# Altium schematic sheet Sheet2.SchDoc
size A4
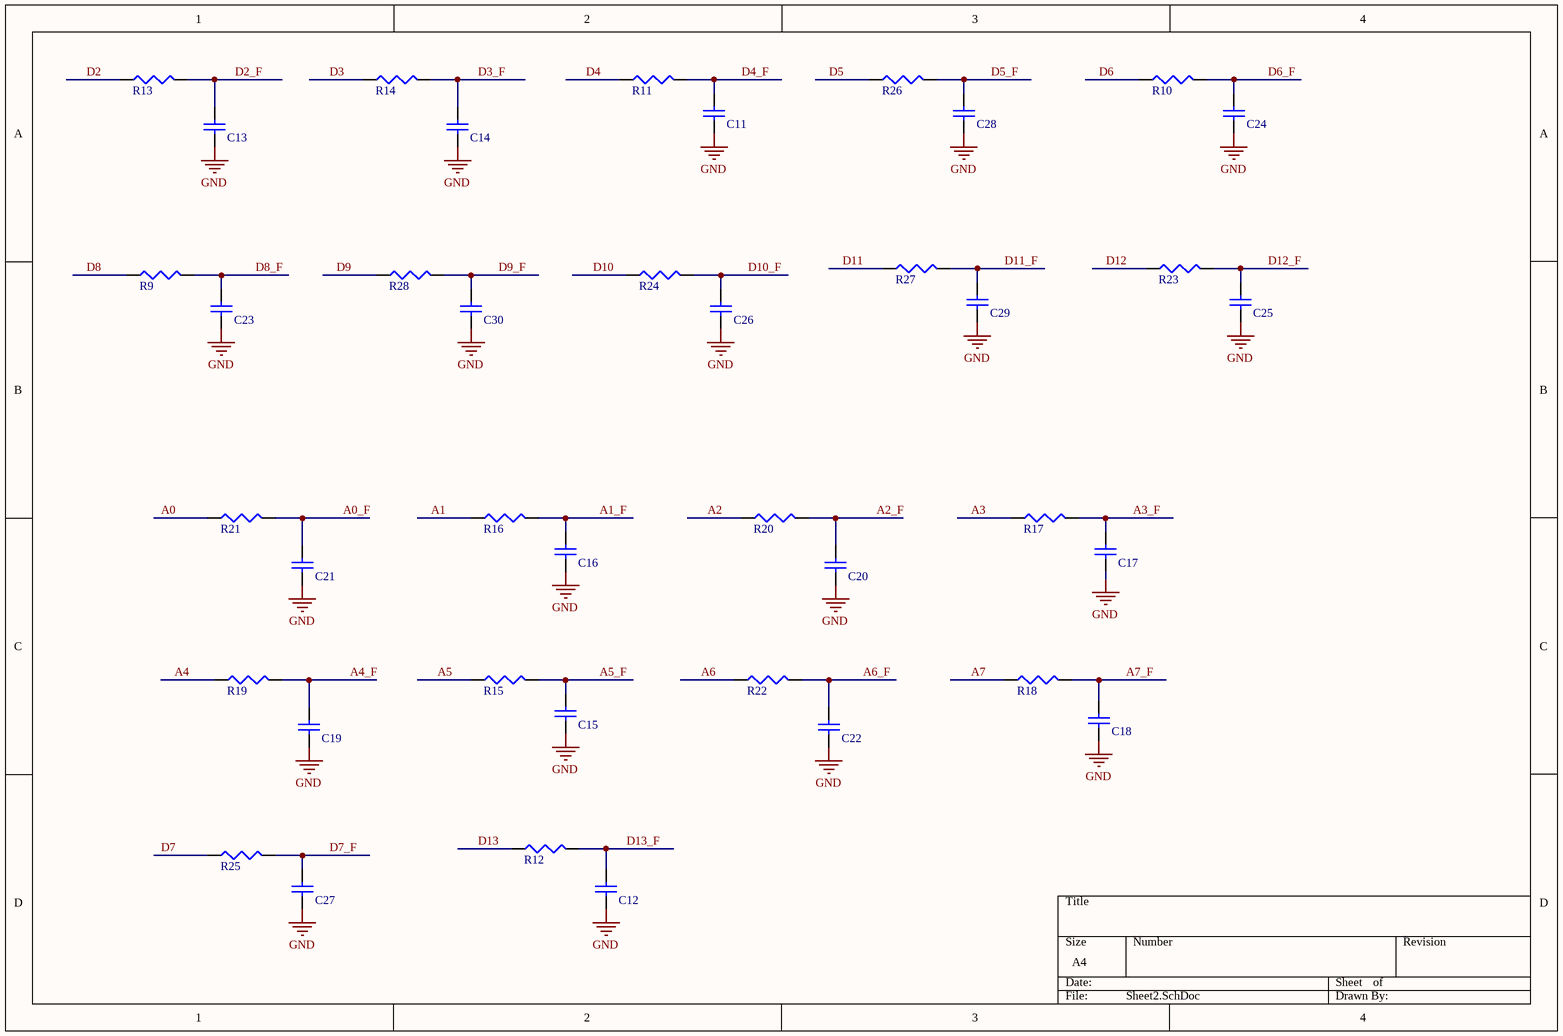
[diagram p0: Sheet2.SchDoc]

## Parts
C11  0.1uF  [CAPC1005X60L]  (value not drawn)
C12  0.1uF  [CAPC1005X60L]  (value not drawn)
C13  0.1uF  [CAPC1005X60L]  (value not drawn)
C14  0.1uF  [CAPC1005X60L]  (value not drawn)
C15  0.1uF  [CAPC1005X60L]  (value not drawn)
C16  0.1uF  [CAPC1005X60L]  (value not drawn)
C17  0.1uF  [CAPC1005X60L]  (value not drawn)
C18  0.1uF  [CAPC1005X60L]  (value not drawn)
C19  0.1uF  [CAPC1005X60L]  (value not drawn)
C20  0.1uF  [CAPC1005X60L]  (value not drawn)
C21  0.1uF  [CAPC1005X60L]  (value not drawn)
C22  0.1uF  [CAPC1005X60L]  (value not drawn)
C23  0.1uF  [CAPC1005X60L]  (value not drawn)
C24  0.1uF  [CAPC1005X60L]  (value not drawn)
C25  0.1uF  [CAPC1005X60L]  (value not drawn)
C26  0.1uF  [CAPC1005X60L]  (value not drawn)
C27  0.1uF  [CAPC1005X60L]  (value not drawn)
C28  0.1uF  [CAPC1005X60L]  (value not drawn)
C29  0.1uF  [CAPC1005X60L]  (value not drawn)
C30  0.1uF  [CAPC1005X60L]  (value not drawn)
R9  75R  [RESC1005X40L]  (value not drawn)
R10  75R  [RESC1005X40L]  (value not drawn)
R11  75R  [RESC1005X40L]  (value not drawn)
R12  75R  [RESC1005X40L]  (value not drawn)
R13  75R  [RESC1005X40L]  (value not drawn)
R14  75R  [RESC1005X40L]  (value not drawn)
R15  75R  [RESC1005X40L]  (value not drawn)
R16  75R  [RESC1005X40L]  (value not drawn)
R17  75R  [RESC1005X40L]  (value not drawn)
R18  75R  [RESC1005X40L]  (value not drawn)
R19  75R  [RESC1005X40L]  (value not drawn)
R20  75R  [RESC1005X40L]  (value not drawn)
R21  75R  [RESC1005X40L]  (value not drawn)
R22  75R  [RESC1005X40L]  (value not drawn)
R23  75R  [RESC1005X40L]  (value not drawn)
R24  75R  [RESC1005X40L]  (value not drawn)
R25  75R  [RESC1005X40L]  (value not drawn)
R26  75R  [RESC1005X40L]  (value not drawn)
R27  75R  [RESC1005X40L]  (value not drawn)
R28  75R  [RESC1005X40L]  (value not drawn)

## Nets
GND: C11.1 C12.1 C13.1 C14.1 C15.1 C16.1 C17.1 C18.1 C19.1 C20.1 C21.1 C22.1 C23.1 C24.1 C25.1 C26.1 C27.1 C28.1 C29.1 C30.1
A0: R21.1
A0_F: C21.2 R21.2
A1: R16.1
A1_F: C16.2 R16.2
A2: R20.1
A2_F: C20.2 R20.2
A3: R17.1
A3_F: C17.2 R17.2
A4: R19.1
A4_F: C19.2 R19.2
A5: R15.1
A5_F: C15.2 R15.2
A6: R22.1
A6_F: C22.2 R22.2
A7: R18.1
A7_F: C18.2 R18.2
D2: R13.1
D2_F: C13.2 R13.2
D3: R14.1
D3_F: C14.2 R14.2
D4: R11.1
D4_F: C11.2 R11.2
D5: R26.1
D5_F: C28.2 R26.2
D6: R10.1
D6_F: C24.2 R10.2
D7: R25.1
D7_F: C27.2 R25.2
D8: R9.1
D8_F: C23.2 R9.2
D9: R28.1
D9_F: C30.2 R28.2
D10: R24.1
D10_F: C26.2 R24.2
D11: R27.1
D11_F: C29.2 R27.2
D12: R23.1
D12_F: C25.2 R23.2
D13: R12.1
D13_F: C12.2 R12.2

## Library data of the parts
C11-C30 = CAP-CER-1: 0.1uF, Ceramic Capacitor; Manufacturer: VENKEL; PartNum: C0402X7R160-104KN; Tolerance: 10%; Rating: 16V; Dielectric: X7R; POD number: CAP-CER-1; RoHS: Y; Value: 0.1uF; Sort Value: 0.1; Category: Capacitors; Subcategory: Ceramic
R9-R28 = RES-TF-32: 75R, 1.1mm x 0.5mm, Thick Film Resistor; Manufacturer: ROYALOHM; PartNum: 0402WGJ0750T1E; Tolerance: 5%; Rating: 0.0625W; POD number: RES-TF-32; RoHS: Y; Value: 75R; Sort Value: 75; Category: Resistors; Subcategory: ThickFilm; HelpURL: http://www.royalohm.com/pdf/general.pdf